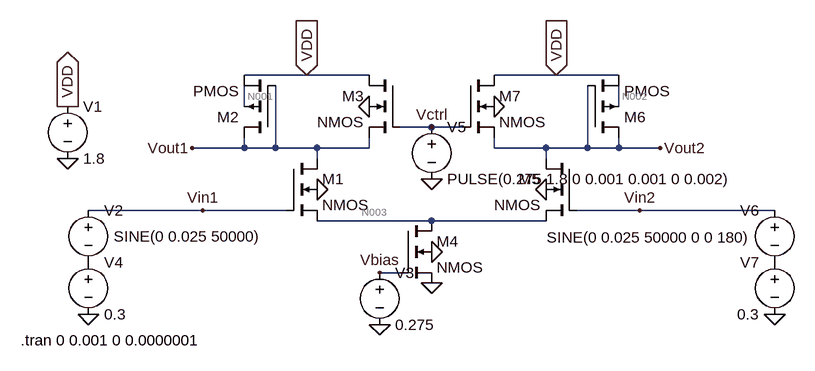
[diagram p0: schematic Differential_VGA.asc]
Differential_VGA.asc, the LTspice schematic file:
Version 4
SHEET 1 1012 680
WIRE 256 64 160 64
WIRE 352 64 256 64
WIRE 640 64 544 64
WIRE 736 64 640 64
WIRE 160 112 160 80
WIRE 736 112 736 80
WIRE 448 144 400 144
WIRE 496 144 448 144
WIRE 160 176 160 160
WIRE 160 176 80 176
WIRE 208 176 208 80
WIRE 208 176 160 176
WIRE 272 176 208 176
WIRE 352 176 352 160
WIRE 352 176 272 176
WIRE 544 176 544 160
WIRE 624 176 544 176
WIRE 688 176 688 80
WIRE 688 176 624 176
WIRE 736 176 736 160
WIRE 736 176 688 176
WIRE 800 176 736 176
WIRE 272 192 272 176
WIRE 624 192 624 176
WIRE 96 272 -80 272
WIRE 224 272 96 272
WIRE 768 272 672 272
WIRE 976 272 768 272
WIRE 448 288 272 288
WIRE 624 288 448 288
WIRE 400 368 368 368
FLAG 352 112 0
FLAG 272 240 0
FLAG 448 336 0
FLAG 256 64 VDD
IOPIN 256 64 In
FLAG -112 112 VDD
IOPIN -112 112 Out
FLAG 448 384 0
FLAG 368 448 0
FLAG -112 192 0
FLAG -80 432 0
FLAG 448 224 0
FLAG 544 112 0
FLAG 624 240 0
FLAG 640 64 VDD
IOPIN 640 64 In
FLAG 976 432 0
FLAG 96 272 Vin1
FLAG 768 272 Vin2
FLAG 80 176 Vout1
FLAG 800 176 Vout2
FLAG 448 144 Vctrl
FLAG 368 368 Vbias
SYMBOL nmos4 224 192 R0
SYMATTR InstName M1
SYMATTR Value2 l=100nm w=120nm
SYMBOL pmos4 208 160 R180
SYMATTR InstName M2
SYMATTR Value2 l=1um w=180nm
SYMBOL nmos4 400 64 M0
SYMATTR InstName M3
SYMATTR Value2 l=100nm w=120nm
SYMBOL nmos4 400 288 R0
SYMATTR InstName M4
SYMATTR Value2 l=100nm w=120nm
SYMBOL voltage -112 96 R0
WINDOW 123 0 0 Left 0
WINDOW 39 0 0 Left 0
SYMATTR InstName V1
SYMATTR Value 1.8
SYMBOL voltage -80 256 R0
WINDOW 3 39 56 Left 2
WINDOW 123 0 0 Left 0
WINDOW 39 0 0 Left 0
SYMATTR Value SINE(0 0.025 50000)
SYMATTR InstName V2
SYMBOL voltage 368 352 R0
WINDOW 123 0 0 Left 0
WINDOW 39 0 0 Left 0
SYMATTR InstName V3
SYMATTR Value 0.275
SYMBOL voltage -80 336 R0
WINDOW 123 0 0 Left 0
WINDOW 39 0 0 Left 0
SYMATTR InstName V4
SYMATTR Value 0.3
SYMBOL voltage 448 128 R0
WINDOW 123 0 0 Left 0
WINDOW 39 0 0 Left 0
SYMATTR InstName V5
SYMATTR Value PULSE(0.275 1.8 0 0.001 0.001 0 0.002)
SYMBOL nmos4 672 192 M0
SYMATTR InstName M5
SYMATTR Value2 l=100nm w=120nm
SYMBOL pmos4 688 160 M180
SYMATTR InstName M6
SYMATTR Value2 l=1um w=180nm
SYMBOL nmos4 496 64 R0
SYMATTR InstName M7
SYMATTR Value2 l=100nm w=120nm
SYMBOL voltage 976 256 M0
WINDOW 3 36 58 Left 2
WINDOW 123 0 0 Left 0
WINDOW 39 0 0 Left 0
SYMATTR Value SINE(0 0.025 50000 0 0 180)
SYMATTR InstName V6
SYMBOL voltage 976 336 M0
WINDOW 123 0 0 Left 0
WINDOW 39 0 0 Left 0
SYMATTR InstName V7
SYMATTR Value 0.3
TEXT -184 472 Left 2 !.tran 0 0.001 0 0.0000001

The netlist it stands for:
* Differential_VGA.asc
M1 Vout1 Vin1 N003 0 NMOS l=100nm w=120nm
M2 Vout1 Vout1 VDD N001 PMOS l=1um w=180nm
M3 VDD Vctrl Vout1 0 NMOS l=100nm w=120nm
M4 N003 Vbias 0 0 NMOS l=100nm w=120nm
V1 VDD 0 1.8
V2 Vin1 P001 SINE(0 0.025 50000)
V3 Vbias 0 0.275
V4 P001 0 0.3
V5 Vctrl 0 PULSE(0.275 1.8 0 0.001 0.001 0 0.002)
M5 Vout2 Vin2 N003 0 NMOS l=100nm w=120nm
M6 Vout2 Vout2 VDD N002 PMOS l=1um w=180nm
M7 VDD Vctrl Vout2 0 NMOS l=100nm w=120nm
V6 Vin2 P002 SINE(0 0.025 50000 0 0 180)
V7 P002 0 0.3
.model NMOS NMOS
.model PMOS PMOS
.lib standard.mos
.tran 0 0.001 0 0.0000001
.backanno
.end

* Results of the author's LTspice run, read from the files saved beside the schematic
* Operating Point, zero values left out:
*   V(vout1) = 1.37 V
*   V(vin1) = 300 mV
*   V(n003) = 133.3 mV
*   V(vdd) = 1.8 V
*   V(n001) = 1.665 V
*   V(vctrl) = 275 mV
*   V(vbias) = 275 mV
*   V(p001) = 300 mV
*   V(vout2) = 1.37 V
*   V(vin2) = 300 mV
*   V(n002) = 1.665 V
*   V(p002) = 300 mV
*   Id(M6) = -333.3 nA
*   Ib(M6) = -1.666 pA
*   Is(M6) = 333.3 nA
*   Id(M2) = -333.3 nA
*   Ib(M2) = -1.666 pA
*   Is(M2) = 333.3 nA
*   Id(M7) = 2.24 pA
*   Ib(M7) = -3.19 pA
*   Id(M5) = 333.3 nA
*   Ib(M5) = -1.523 pA
*   Is(M5) = -333.3 nA
*   Id(M4) = 666.7 nA
*   Is(M4) = -666.7 nA
*   Id(M3) = 2.24 pA
*   Ib(M3) = -3.19 pA
*   Id(M1) = 333.3 nA
*   Ib(M1) = -1.523 pA
*   Is(M1) = -333.3 nA
*   I(V1) = -666.7 nA
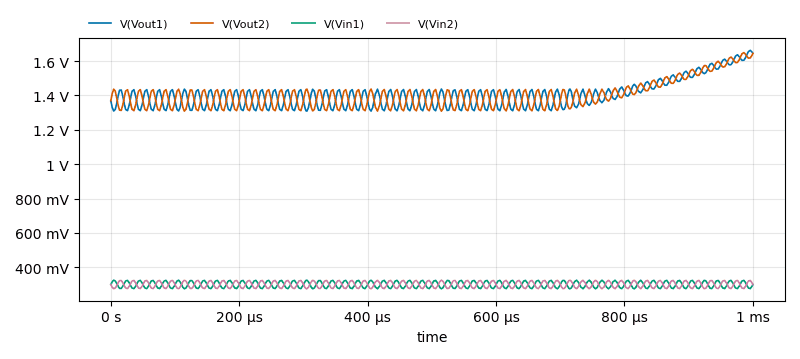
[diagram p1: Transient Analysis of Differential_VGA.asc, plotted from the saved traces]
* Transient Analysis, 1 run:
*   V(Vout1): min 1.309 V, max 1.662 V, average 1.404 V, rms 1.406 V, last 1.645 V
*   V(Vout2): min 1.309 V, max 1.649 V, average 1.404 V, rms 1.406 V, last 1.645 V
*   V(Vin1): min 275 mV, max 324.9 mV, average 300 mV, rms 300.5 mV, last 300 mV
*   V(Vin2): min 275.1 mV, max 325 mV, average 300 mV, rms 300.5 mV, last 300 mV